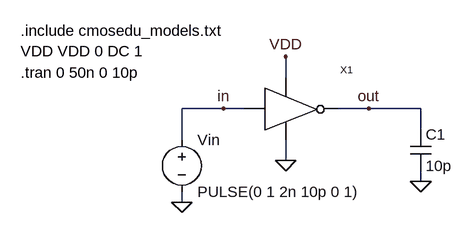
[diagram p0: schematic inverter_sim_tran.asc]
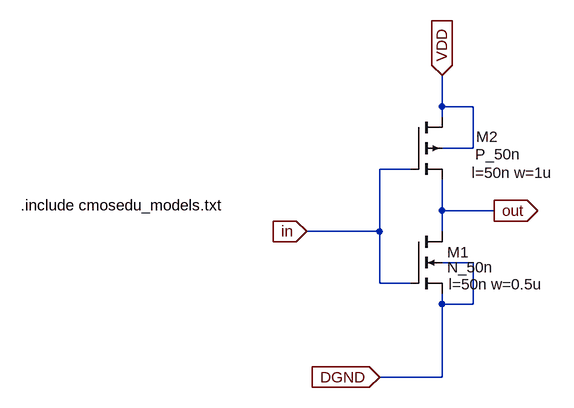
[diagram p1: sub-circuit inverter.asc]
inverter_sim_tran.asc, the LTspice schematic file:
Version 4
SHEET 1 880 680
WIRE 160 112 160 80
WIRE 64 160 0 160
WIRE 96 160 64 160
WIRE 288 160 240 160
WIRE 368 160 288 160
WIRE 368 192 368 160
WIRE 0 208 0 160
WIRE 160 240 160 208
WIRE 368 272 368 256
WIRE 0 304 0 288
FLAG 64 160 in
FLAG 288 160 out
FLAG 0 304 0
FLAG 160 240 0
FLAG 160 80 VDD
FLAG 368 272 0
SYMBOL voltage 0 192 R0
WINDOW 123 0 0 Left 0
WINDOW 39 0 0 Left 0
SYMATTR InstName Vin
SYMATTR Value PULSE(0 1 2n 10p 0 1)
SYMBOL inverter 128 160 R0
SYMATTR InstName X1
SYMBOL cap 352 192 R0
SYMATTR InstName C1
SYMATTR Value 10p
TEXT -248 40 Left 2 !.include cmosedu_models.txt\nVDD VDD 0 DC 1
TEXT -248 104 Left 2 !.tran 0 50n 0 10p

inverter.asc, the sub-circuit schematic file:
Version 4
SHEET 1 880 680
WIRE 176 -32 176 -80
WIRE 224 -32 176 -32
WIRE 176 -16 176 -32
WIRE 224 32 224 -32
WIRE 224 32 176 32
WIRE 128 64 80 64
WIRE 176 128 176 80
WIRE 256 128 176 128
WIRE 80 160 80 64
WIRE 80 160 -32 160
WIRE 176 160 176 128
WIRE 224 208 176 208
WIRE 80 240 80 160
WIRE 128 240 80 240
WIRE 176 272 176 256
WIRE 224 272 224 208
WIRE 224 272 176 272
WIRE 176 384 176 272
WIRE 176 384 80 384
FLAG 176 -80 VDD
IOPIN 176 -80 In
FLAG -32 160 in
IOPIN -32 160 In
FLAG 256 128 out
IOPIN 256 128 Out
FLAG 80 384 DGND
IOPIN 80 384 In
SYMBOL nmos4 128 160 R0
WINDOW 3 56 55 Left 2
WINDOW 123 58 81 Left 2
SYMATTR Value N_50n
SYMATTR Value2 l=50n w=0.5u
SYMATTR InstName M1
SYMBOL pmos4 128 -16 R0
WINDOW 0 101 30 Left 2
WINDOW 3 99 57 Left 2
WINDOW 123 94 86 Left 2
SYMATTR InstName M2
SYMATTR Value P_50n
SYMATTR Value2 l=50n w=1u
TEXT -472 120 Left 2 !.include cmosedu_models.txt

The netlist it stands for:
* inverter_sim_tran.asc
Vin in 0 PULSE(0 1 2n 10p 0 1)
XX1 in out VDD 0 inverter
C1 out 0 10p

* block symbol definitions
.subckt inverter in out VDD DGND
M1 out in DGND DGND N_50n l=50n w=0.5u
M2 VDD in out VDD P_50n l=50n w=1u
.include cmosedu_models.txt
.ends inverter

.model NMOS NMOS
.model PMOS PMOS
.lib standard.mos
.include cmosedu_models.txt
VDD VDD 0 DC 1
.tran 0 50n 0 10p
.backanno
.end

* Results of the author's LTspice run, read from the files saved beside the schematic
* Operating Point, zero values left out:
*   V(out) = 1 V
*   V(vdd) = 1 V
*   I(Vin) = 18.19 nA
*   I(Vdd) = -21.21 nA
*   Ix(x1:IN) = -18.19 nA
*   Ix(x1:VDD) = 21.21 nA
*   Ix(x1:DGND) = -3.022 nA
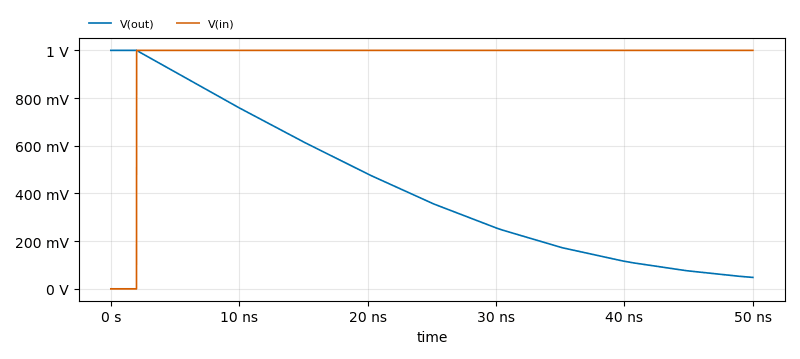
[diagram p2: Transient Analysis of inverter_sim_tran.asc, plotted from the saved traces]
* Transient Analysis, 1 run:
*   V(out): min 47.67 mV, max 1 V, average 428.6 mV, rms 529.3 mV, last 47.67 mV
*   V(in): min 0 V, max 1 V, average 959.9 mV, rms 979.7 mV, last 1 V